# EAGLE design MainBoard (EAGLE 9.7.0)
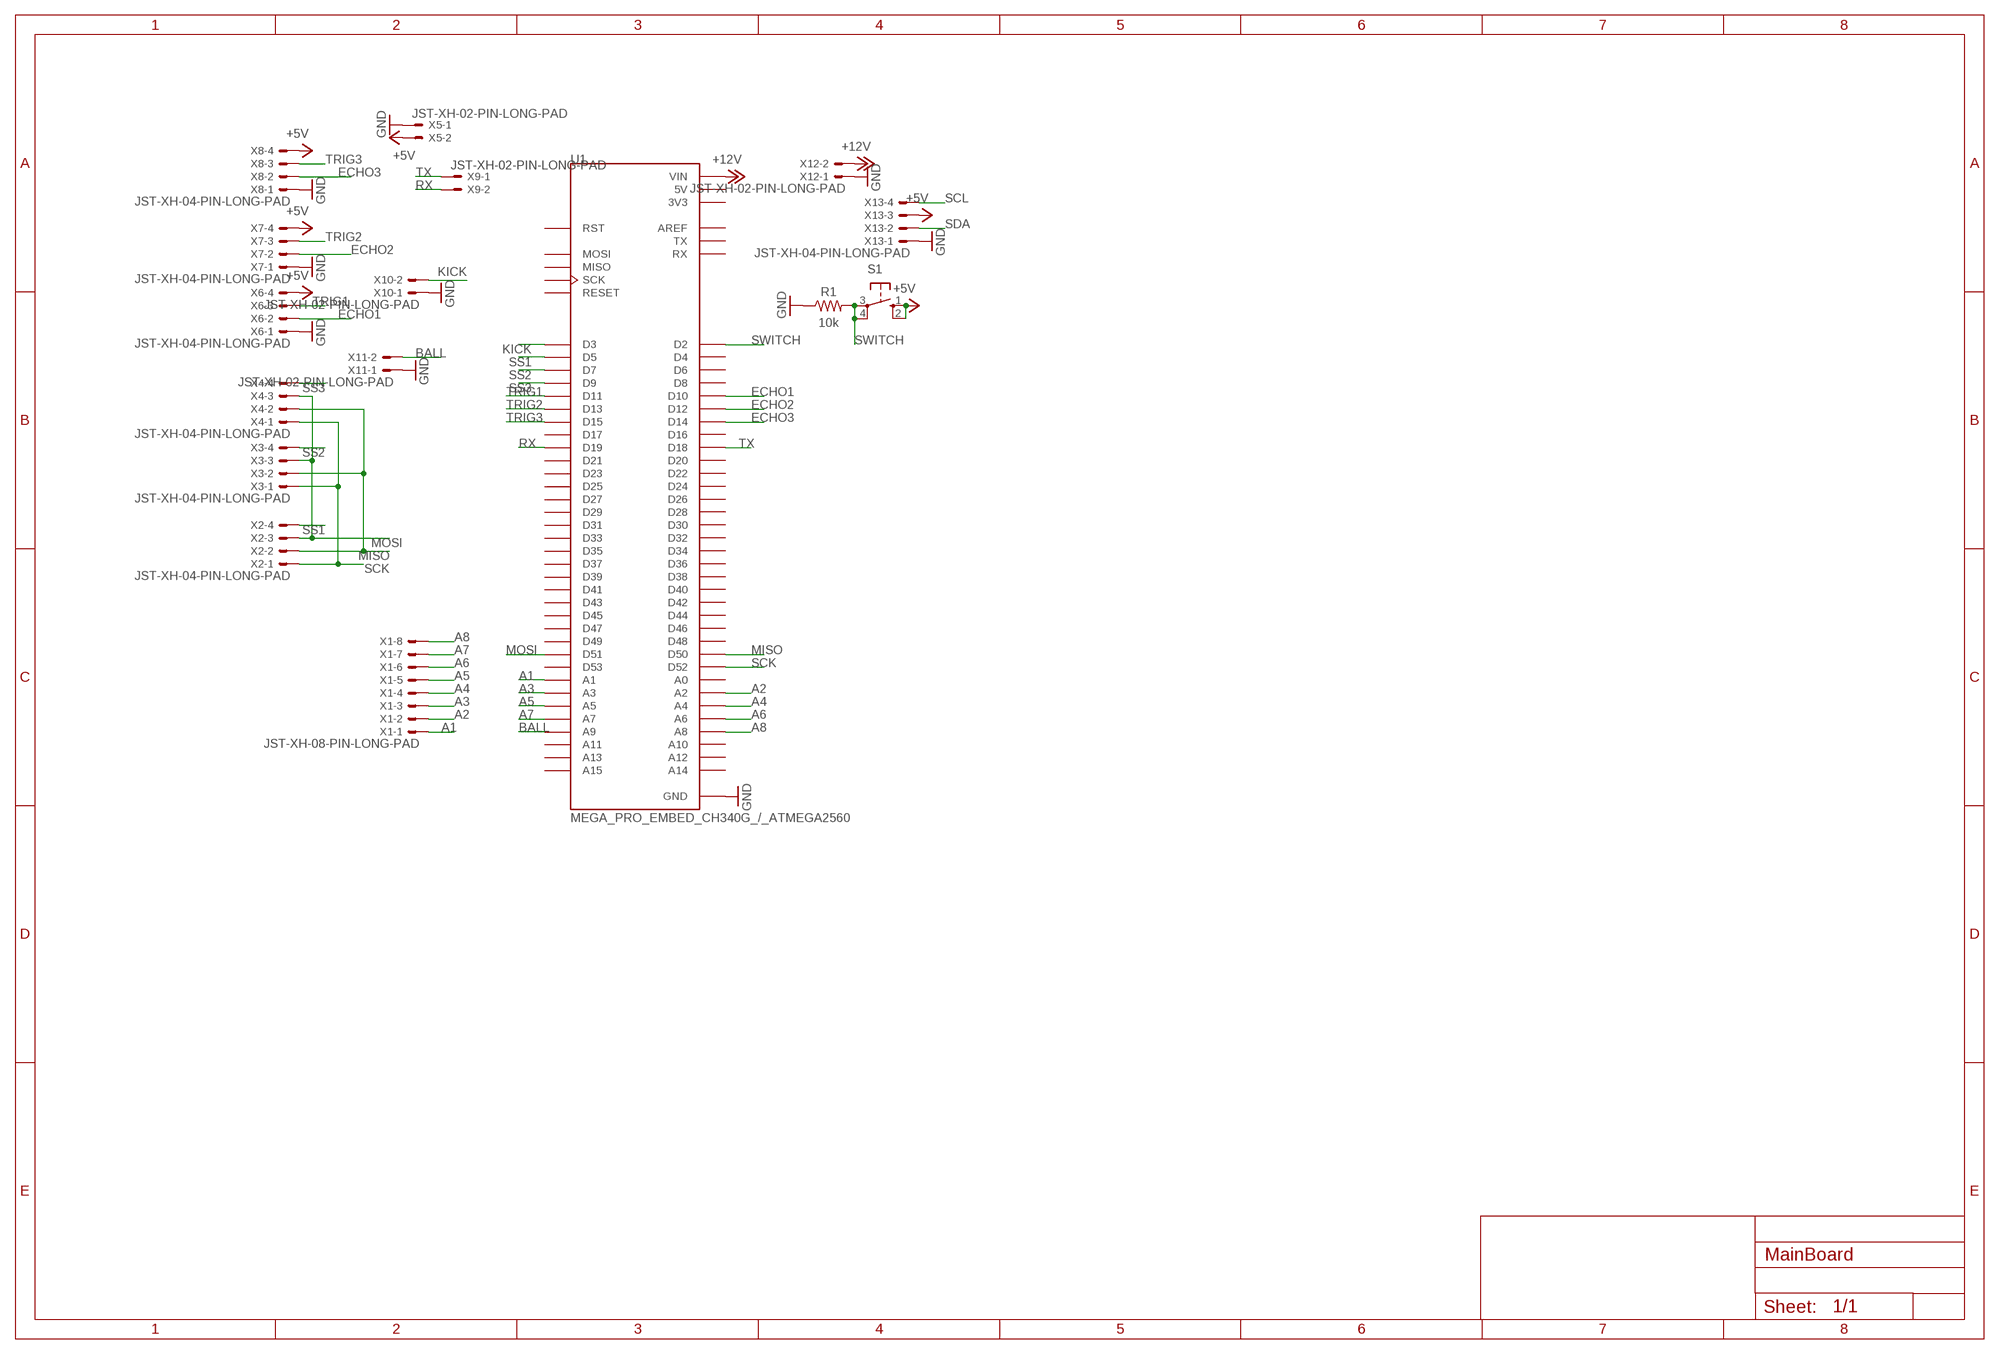
[diagram p0: schematic, sheet 1]

## Parts
R1  10k  R-US_CHIP-0603(1608-METRIC)  [RESC1608X60]
S1  10-XX  [B3F-10XX]
U1  MEGA_PRO_EMBED_CH340G_/_ATMEGA2560  [MODULE_MEGA_PRO_EMBED_CH340G_/_ATMEGA2560]
X1  JST-XH-08-PIN-LONG-PAD  [JST-XH-08-PACKAGE-LONG-PAD]
X2  JST-XH-04-PIN-LONG-PAD  [JST-XH-04-PACKAGE-LONG-PAD]
X3  JST-XH-04-PIN-LONG-PAD  [JST-XH-04-PACKAGE-LONG-PAD]
X4  JST-XH-04-PIN-LONG-PAD  [JST-XH-04-PACKAGE-LONG-PAD]
X5  JST-XH-02-PIN-LONG-PAD  [JST-XH-02-PACKAGE-LONG-PAD]
X6  JST-XH-04-PIN-LONG-PAD  [JST-XH-04-PACKAGE-LONG-PAD]
X7  JST-XH-04-PIN-LONG-PAD  [JST-XH-04-PACKAGE-LONG-PAD]
X8  JST-XH-04-PIN-LONG-PAD  [JST-XH-04-PACKAGE-LONG-PAD]
X9  JST-XH-02-PIN-LONG-PAD  [JST-XH-02-PACKAGE-LONG-PAD]
X10  JST-XH-02-PIN-LONG-PAD  [JST-XH-02-PACKAGE-LONG-PAD]
X11  JST-XH-02-PIN-LONG-PAD  [JST-XH-02-PACKAGE-LONG-PAD]
X12  JST-XH-02-PIN-LONG-PAD  [JST-XH-02-PACKAGE-LONG-PAD]
X13  JST-XH-04-PIN-LONG-PAD  [JST-XH-04-PACKAGE-LONG-PAD]

## Nets
+5V: S1.1(S) S1.2(S1) X5.2 X6.4 X7.4 X8.4 X13.3
+12V: U1.VIN_1(VIN) U1.VIN_2(VIN) X12.2
A1: U1.A1 X1.1
A2: U1.A2 X1.2
A3: U1.A3 X1.3
A4: U1.A4 X1.4
A5: U1.A5 X1.5
A6: U1.A6 X1.6
A7: U1.A7 X1.7
A8: U1.A8 X1.8
BALL: U1.A9 X11.2
ECHO1: U1.D10 X6.2
ECHO2: U1.D12 X7.2
ECHO3: U1.D14 X8.2
GND: R1.1 U1.GND_1(GND) U1.GND_2(GND) U1.GND_3(GND) X5.1 X6.1 X7.1 X8.1 X10.1 X11.1 X12.1 X13.1
KICK: U1.D3 X10.2
MISO: U1.D50 X2.2 X3.2 X4.2
MOSI: U1.D51 X2.3 X3.3 X4.3
RX: U1.D19 X9.2
SCK: U1.D52 X2.1 X3.1 X4.1
SCL: X13.4
SDA: X13.2
SS1: U1.D5 X2.4
SS2: U1.D7 X3.4
SS3: U1.D9 X4.4
SWITCH: R1.2 S1.3(P) S1.4(P1) U1.D2
TRIG1: U1.D11 X6.3
TRIG2: U1.D13 X7.3
TRIG3: U1.D15 X8.3
TX: U1.D18 X9.1
Unconnected: U1.A0 U1.A10 U1.A11 U1.A12 U1.A13 U1.A14 U1.A15 U1.AREF U1.D4 U1.D6 U1.D8 U1.D16 U1.D17 U1.D20 U1.D21 U1.D22 U1.D23 U1.D24 U1.D25 U1.D26 U1.D27 U1.D28 U1.D29 U1.D30 U1.D31 U1.D32 U1.D33 U1.D34 U1.D35 U1.D36 U1.D37 U1.D38 U1.D39 U1.D40 U1.D41 U1.D42 U1.D43 U1.D44 U1.D45 U1.D46 U1.D47 U1.D48 U1.D49 U1.D53 U1.MISO U1.MOSI U1.RESET U1.RST U1.RX U1.SCK U1.TX

## Power pins joined to a net without a drawn wire
3V3: U1.3V3_1(3V3) U1.3V3_2(3V3)
5V: U1.5V_1(5V) U1.5V_2(5V) U1.5V_3(5V)

## Library data of the parts
R1 = Resistor:R-US: Resistor Fixed - ANSI; CATEGORY: Resistor; SUB-CATEGORY: Fixed
S1 = switch-omron:10-XX: OMRON SWITCH; MPN: B3F-1000; OC_FARNELL: 176432; OC_NEWARK: 36M3542
U1 = MEGA_PRO_EMBED_CH340G___ATMEGA2560:MEGA_PRO_EMBED_CH340G_/_ATMEGA2560: Mega 2560 PRO (Embed) CH340G/ATmega2560-16AU Check availability <https://pricing.snapeda.com/parts/Mega%20Pro%20Embed%20CH340G%20/%20ATmega2560/Robotdyn/view-part?ref=eda>; AVAILABILITY: Not in stock; MF: Robotdyn; MP: Mega Pro Embed CH340G / ATmega2560; PACKAGE: None; PRICE: None
X1 = Rembrandt Electronics - JST XH Connectors v1-0:JST-XH-08-PIN: JST XH Connector 2 Pin Wire to board connector. Pitch: 2,54 mm, (0.100") Number of pins: 8 Created by Rembrandt Electronics www.rembrandtelectronics.com
X2-X4 X6-X8 X13 = Rembrandt Electronics - JST XH Connectors v1-0:JST-XH-04-PIN: JST XH Connector 2 Pin Wire to board connector. Pitch: 2,54 mm, (0.100") Number of pins: 4 Created by Rembrandt Electronics www.rembrandtelectronics.com
X5 X9-X12 = Rembrandt Electronics - JST XH Connectors v1-0:JST-XH-02-PIN: JST XH Connector 2 Pin Wire to board connector. Pitch: 2,54 mm, (0.100") Number of pins: 2 Created by Rembrandt Electronics www.rembrandtelectronics.com

## Board
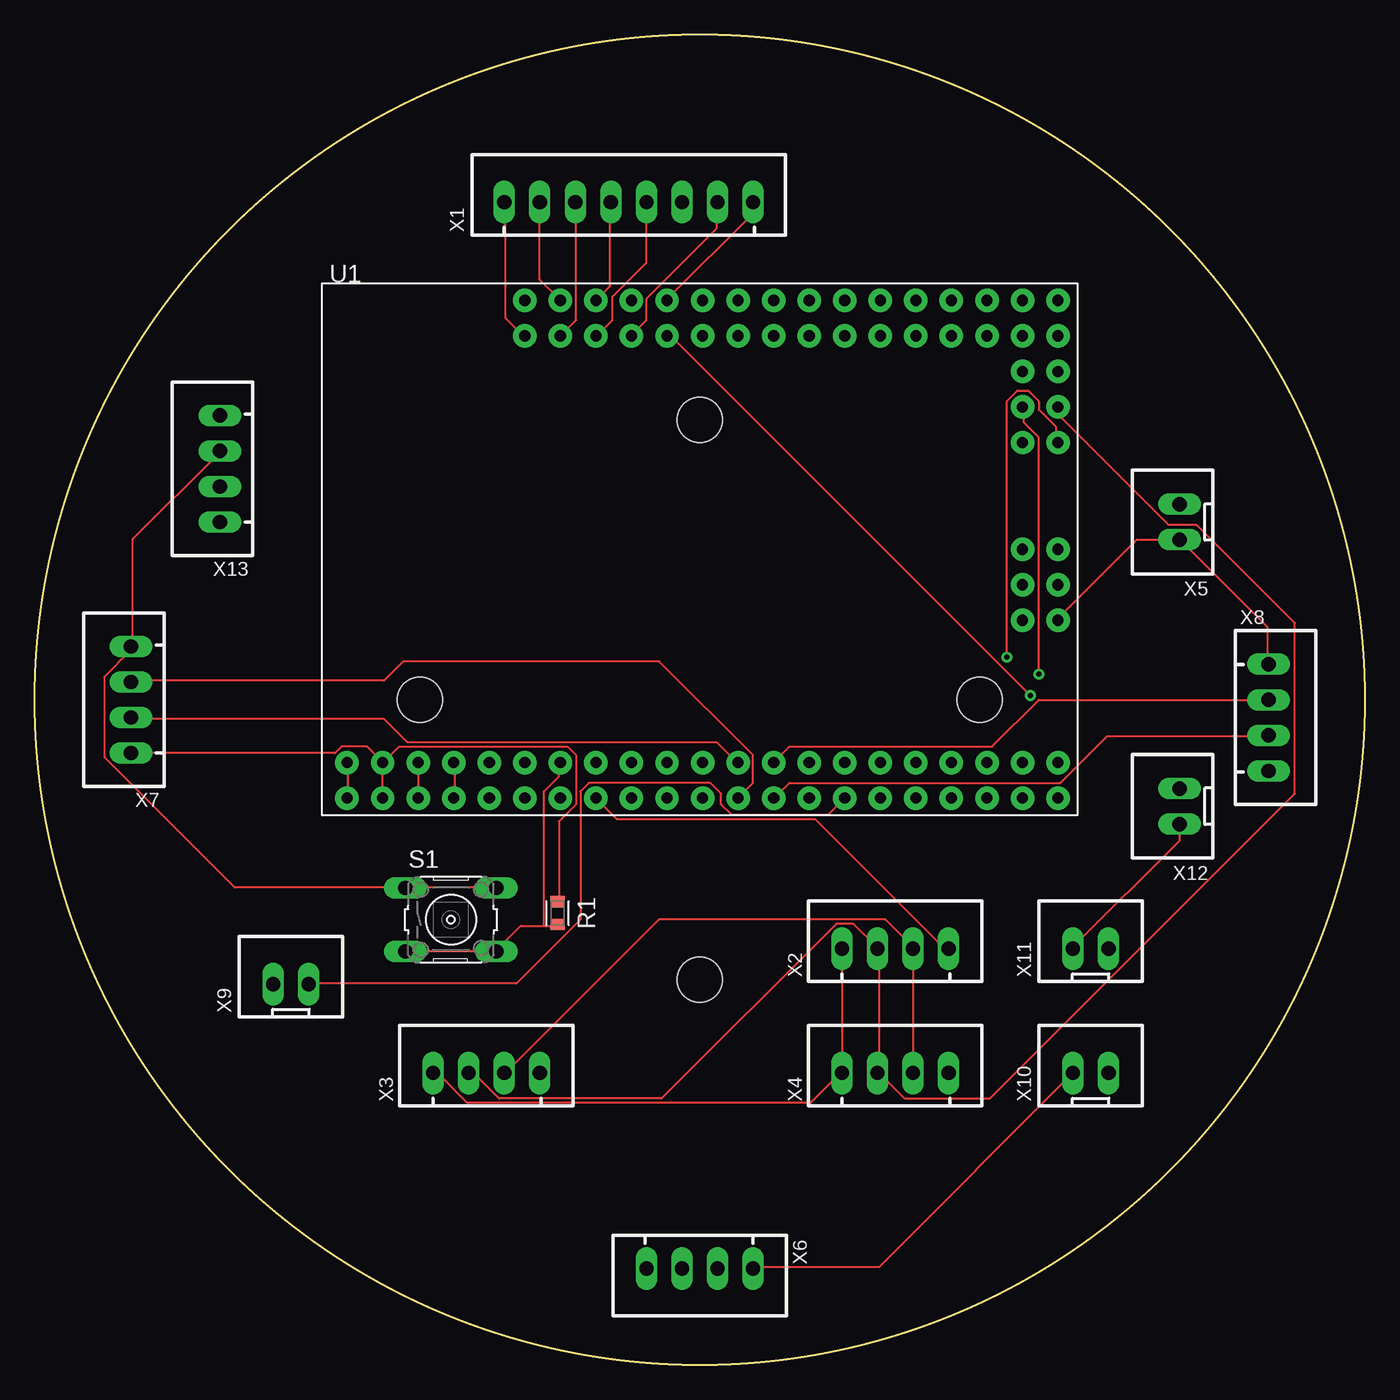
[diagram p1: board, top side]
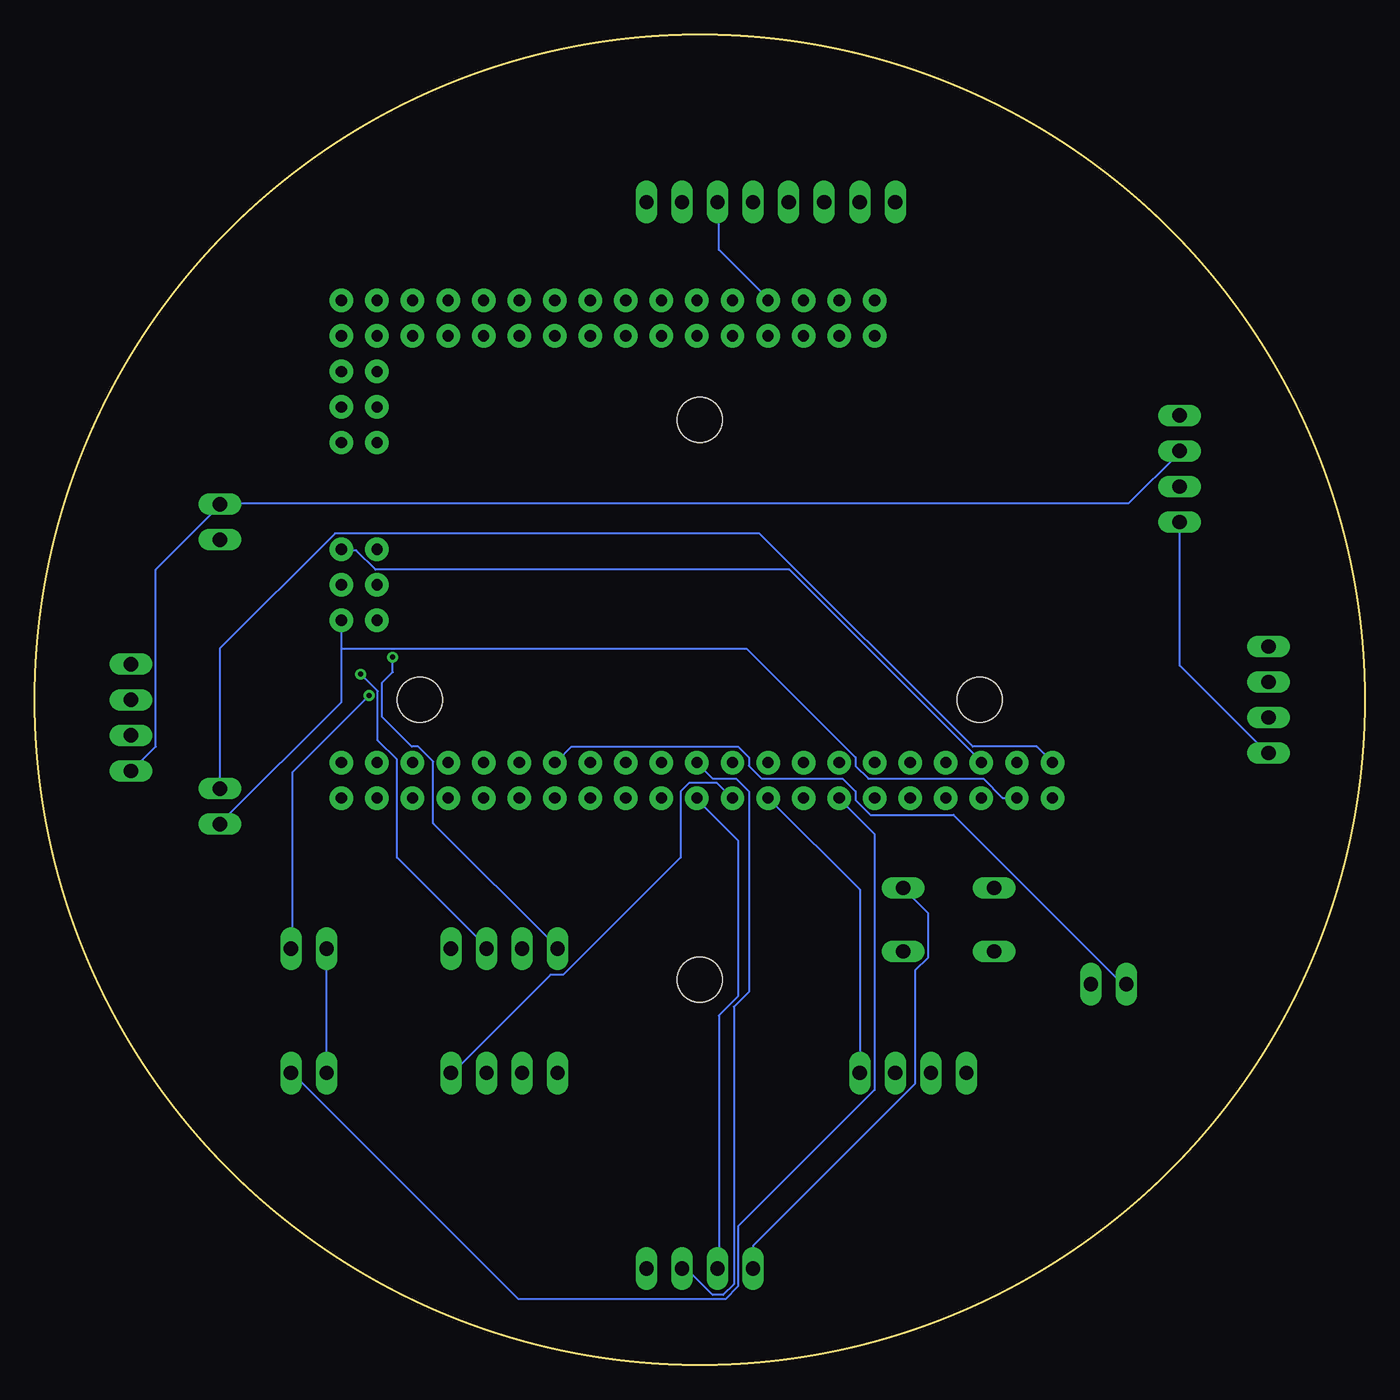
[diagram p2: board, bottom side, seen from below]

Size 95 x 95 mm. Coordinates in mm from the lower left corner, seen from the top.
Outline: circle at 47.5,47.5 radius 47.5
Copper layers (1*16): Top 0.035mm / dielectric 1.5mm / Bottom 0.035mm
Design rules "default": minimum track width 6mil, minimum drill 0.35mm, track to track 6mil, track to pad 6mil, pad to pad 6mil, via to via 6mil, smd to smd 6mil, copper to edge 40mil, drill to drill 6mil, minimum pad ring 10mil, minimum via ring 8mil, stop-mask expansion 4mil, vias tented up to drill 0mil, thermal gap 10mil
Holes 3.2 mm at 27.5,47.5 67.5,47.5 47.5,67.5 47.5,27.5

### Footprints (pad centres in the part's own frame; a part is rotated, then mirrored left to right if it is on the bottom)
RESC1608X60 = smd 0.799 x 0.974: 1 -0.815,0; 2 0.815,0
B3F-10XX = drill 1.016 long: 1 -3.251,2.261; 2 3.251,2.261; 3 -3.251,-2.261; 4 3.251,-2.261
MODULE_MEGA_PRO_EMBED_CH340G_/_ATMEGA2560 = drill 0.8 pad 1.676: 3V3_1 -17.58,-17.78; 3V3_2 -17.58,-15.24; 5V_1 -20.12,-17.78; 5V_2 -20.12,-15.24; 5V_3 25.6,0; A0 -12.5,17.78; A1 -12.5,15.24; A2 -9.96,17.78; A3 -9.96,15.24; A4 -7.42,17.78; A5 -7.42,15.24; A6 -4.88,17.78; A7 -4.88,15.24; A8 -2.34,17.78; A9 -2.34,15.24; A10 0.2,17.78; A11 0.2,15.24; A12 2.74,17.78; A13 2.74,15.24; A14 5.28,17.78; A15 5.28,15.24; AREF -15.04,-15.24; D2 -9.96,-15.24; D3 -9.96,-17.78; D4 -7.42,-15.24; D5 -7.42,-17.78; D6 -4.88,-15.24; D7 -4.88,-17.78; D8 -2.34,-15.24; D9 -2.34,-17.78; D10 0.2,-15.24; D11 0.2,-17.78; D12 2.74,-15.24; D13 2.74,-17.78; D14 5.28,-15.24; D15 5.28,-17.78; D16 7.82,-15.24; D17 7.82,-17.78; D18 10.36,-15.24; D19 10.36,-17.78; D20 12.9,-15.24; D21 12.9,-17.78; D22 15.44,-15.24; D23 15.44,-17.78; D24 17.98,-15.24; D25 17.98,-17.78; D26 20.52,-15.24; D27 20.52,-17.78; D28 23.06,-15.24; D29 23.06,-17.78; D30 25.6,-15.24; D31 25.6,-17.78; D32 7.82,17.78; D33 7.82,15.24; D34 10.36,17.78; D35 10.36,15.24; D36 12.9,17.78; D37 12.9,15.24; D38 15.44,17.78; D39 15.44,15.24; D40 17.98,17.78; D41 17.98,15.24; D42 20.52,17.78; D43 20.52,15.24; D44 23.06,17.78; D45 23.06,15.24; D46 25.6,17.78; D47 25.6,15.24; D48 25.6,12.7; D49 23.06,12.7; D50 25.6,10.16; D51 23.06,10.16; D52 25.6,7.62; D53 23.06,7.62; GND_1 -22.66,-17.78; GND_2 -22.66,-15.24; GND_3 25.6,-5.08; MISO 23.06,0; MOSI 25.6,-2.54; RESET 23.06,-5.08; RST -15.04,-17.78; RX -12.5,-15.24; SCK 23.06,-2.54; TX -12.5,-17.78; VIN_1 -25.2,-17.78; VIN_2 -25.2,-15.24
JST-XH-08-PACKAGE-LONG-PAD = drill 1.016 long: 1 -8.89,0; 2 -6.35,0; 3 -3.81,0; 4 -1.27,0; 5 1.27,0; 6 3.81,0; 7 6.35,0; 8 8.89,0
JST-XH-04-PACKAGE-LONG-PAD = drill 1.016 long: 1 -3.81,0; 2 -1.27,0; 3 1.27,0; 4 3.81,0
JST-XH-02-PACKAGE-LONG-PAD = drill 1.016 long: 1 -1.27,0; 2 1.27,0

### Placement (x,y rotation side)
R1  37.34,32.26 270 top
S1  29.72,31.79 0 top
U1  47.5,58.25 0 top
X1  42.42,83.06 0 top
X2  61.47,29.72 0 top
X3  32.26,20.83 0 top
X4  61.47,20.83 0 top
X5  81.79,60.2 90 top
X6  47.5,6.86 180 top
X7  6.86,47.5 90 top
X8  88.14,46.23 270 top
X9  18.29,27.18 0 top
X10  75.44,20.83 0 top
X11  75.44,29.72 0 top
X12  81.79,39.88 90 top
X13  13.21,64.01 90 top

### Tracks (layer width: path | path; a pad name or v marks a point on that pad's centre or on a via)
3V3
  Top 0.152: U1.3V3_1 29.97,40.49 29.97,42.93 U1.3V3_2
5V
  Top 0.152: U1.5V_1 27.38,40.49 27.38,42.93 U1.5V_2
  Bottom 0.152: U1.5V_3 72.95,58.17 72.04,58.17 70.66,56.8 41.1,56.8 27.38,43.08 U1.5V_2
+5V
  Top 0.152: X13.3 13.21,65.18 6.96,58.93 6.96,51.31 X7.4 6.81,51.31 6.81,51.01 4.98,49.18 4.98,43.38 14.28,34.09 26.47,34.09 | 26.47,34.09 32.87,34.09 S1.2 | 26.47,34.09 S1.1
  Bottom 0.152: X8.4 88.04,42.47 86.36,44.15 86.36,56.8 81.79,61.37 X5.2 81.79,61.52 16.87,61.52 13.21,65.18 X13.3 | X6.4 43.69,8.49 32.11,20.07 32.11,28.14 31.19,29.06 31.19,32.26 32.87,33.94 S1.2
+12V
  Top 0.152: U1.VIN_1 22.35,40.49 22.35,42.93 U1.VIN_2
  Bottom 0.152: X12.2 81.79,51.16 73.56,59.39 43.23,59.39 27.99,44.15 23.42,44.15 22.35,43.08 U1.VIN_2
A1
  Top 0.152: X1.1 33.63,83.01 33.63,74.78 34.85,73.56 U1.A1
A2
  Top 0.152: X1.2 36.07,77.52 37.44,76.15 U1.A2
A3
  Top 0.152: X1.3 38.66,83.01 38.66,74.63 37.59,73.56 U1.A3
A4
  Top 0.152: X1.4 41.1,83.01 41.1,77.07 40.19,76.15 U1.A4
A5
  Top 0.152: X1.5 43.69,78.74 41.25,76.3 41.25,74.63 40.19,73.56 U1.A5
A6
  Bottom 0.152: X1.6 46.13,83.01 46.13,79.66 42.62,76.15 U1.A6
A7
  Top 0.152: X1.7 48.72,83.01 48.72,81.18 43.69,76.15 43.69,74.63 42.62,73.56 U1.A7
A8
  Top 0.152: X1.8 51.31,82.25 45.21,76.15 U1.A8
BALL  (via drill 0.35)
  Top 0.152: v71.12,47.8 45.52,73.41 45.21,73.41 U1.A9
  Bottom 0.152: v71.12,47.8 76.61,42.32 76.61,29.82 X11.2
ECHO1
  Bottom 0.152: X6.2 48.72,6.81 48.41,6.81 46.59,4.98 45.82,4.98 45.06,5.74 45.06,25.55 43.99,26.62 43.99,40.95 44.91,41.86 46.59,41.86 47.65,42.93 U1.D10
ECHO2
  Top 0.152: X7.2 6.96,46.13 24.95,46.13 26.62,44.45 48.72,44.45 50.09,43.08 U1.D12
ECHO3
  Top 0.152: X8.2 71.73,47.5 68.38,44.15 53.9,44.15 52.83,43.08 U1.D14
GND
  Top 0.152: R1.1 37.44,33.17 37.44,38.81 38.66,40.03 38.66,43.54 38.05,44.15 26.01,44.15 24.95,43.08 U1.GND_2 | X7.1 21.44,43.69 21.9,44.15 23.73,44.15 24.79,43.08 U1.GND_2 | U1.GND_1 24.79,40.49 24.79,42.93 U1.GND_2 | U1.GND_3 73.1,53.29 78.74,58.93 X5.1 88.04,52.68 88.04,50.09 X8.1 | X10.1 60.3,6.96 51.31,6.96 X6.1 | X12.1 81.79,37.44 74.17,29.82 X11.1
  Bottom 0.152: X13.1 13.21,49.94 6.96,43.69 X7.1 | X10.1 X11.1 | 73.1,51.16 73.1,47.35 81.79,38.66 X12.1 | 73.1,51.16 73.1,53.14 U1.GND_3 | 73.1,51.16 44.15,51.16 36.38,43.38 36.38,42.78 35.46,41.86 27.23,41.86 25.86,40.49 24.95,40.49 U1.GND_1
KICK
  Bottom 0.152: X10.2 76.61,20.83 60.45,4.68 45.67,4.68 44.76,5.59 44.76,9.86 35,19.61 35,37.9 37.44,40.34 U1.D3
MISO
  Top 0.152: X3.2 31.35,20.83 33.17,19 44.76,19 57.25,31.5 58.47,31.5 60.15,29.82 X2.2 60.3,29.67 60.3,20.83 | 60.3,20.83 62.13,19 68.23,19 90.02,40.79 90.02,52.99 83.01,60 81.03,60 73.1,67.92 73.1,68.38 U1.D50 | 60.3,20.83 X4.2
MOSI  (via drill 0.35)
  Top 0.152: X3.3 33.63,20.83 44.6,31.8 60.76,31.8 62.74,29.82 X2.3 X4.3 | v71.73,49.33 71.73,66.25 70.66,67.31 70.66,68.38 U1.D51
  Bottom 0.152: v71.73,49.33 70.51,48.11 70.51,44.6 69.14,43.23 69.14,36.22 62.74,29.82 X2.3
RX
  Top 0.152: X9.2 19.61,27.23 34.39,27.23 38.97,31.8 38.97,40.95 39.58,41.56 48.26,41.56 49.02,40.79 49.02,40.03 49.79,39.27 56.64,39.27 57.71,40.34 U1.D19
SCK  (via drill 0.35)
  Top 0.152: X3.1 28.75,20.83 30.89,18.7 55.42,18.7 57.56,20.83 X4.1 57.71,20.83 57.71,29.67 X2.1 | v69.45,50.55 69.45,68.84 70.21,69.6 70.97,69.6 71.73,68.84 71.73,68.23 72.95,67.01 72.95,65.94 U1.D52
  Bottom 0.152: v69.45,50.55 69.45,49.48 70.21,48.72 70.21,46.28 68.07,44.15 67.62,44.15 66.55,43.08 66.55,38.66 57.71,29.82 X2.1
SS1
  Top 0.152: X2.4 65.18,29.82 64.87,29.82 55.73,38.97 41.56,38.97 40.19,40.34 U1.D5
SS2
  Bottom 0.152: X3.4 36.07,33.94 42.47,40.34 U1.D7
SS3
  Bottom 0.152: X4.4 65.18,20.83 58.17,27.84 57.25,27.84 48.87,36.22 48.87,40.95 48.26,41.56 46.28,41.56 45.21,40.49 U1.D9
SWITCH
  Top 0.152: 36.38,31.35 34.7,31.35 33.02,29.67 S1.4 32.87,29.52 26.47,29.52 S1.3 | 36.38,31.35 37.29,31.35 R1.2 | 36.38,31.35 36.38,40.95 37.44,42.01 37.44,42.93 U1.D2
TRIG1
  Bottom 0.152: X6.3 46.13,6.96 46.13,24.95 44.76,26.32 44.76,37.44 47.65,40.34 U1.D11
TRIG2
  Top 0.152: X7.3 6.96,48.87 24.95,48.87 26.32,50.24 44.6,50.24 51.31,43.54 51.31,41.56 50.24,40.49 U1.D13
TRIG3
  Top 0.152: X8.3 88.04,44.91 76.61,44.91 73.26,41.56 53.9,41.56 52.83,40.49 U1.D15
TX
  Bottom 0.152: X9.1 17.02,27.23 17.32,27.23 29.36,39.27 35.31,39.27 36.38,40.34 36.38,40.95 37.29,41.86 43.08,41.86 43.99,42.78 43.99,43.38 44.76,44.15 56.64,44.15 57.71,43.08 U1.D18